# EAGLE design Base (EAGLE 7.1.0)
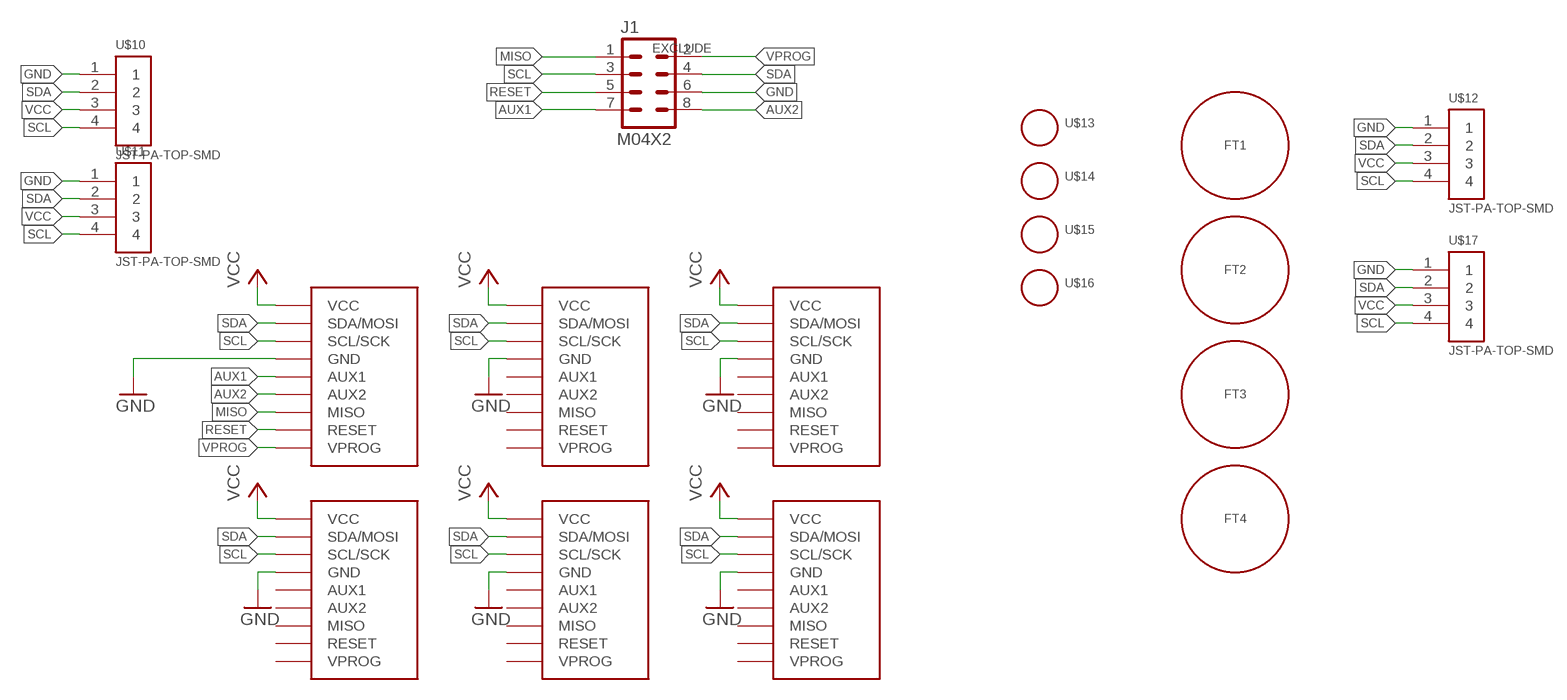
[diagram p0: schematic, sheet 1]

## Parts
FT1  FOOT  [FOOT]
FT2  FOOT  [FOOT]
FT3  FOOT  [FOOT]
FT4  FOOT  [FOOT]
J1  M04X2  [2X4]
U$1  MAGBASE-V2  [MAGBASE-V2]
U$2  MAGBASE-V2  [MAGBASE-V2]
U$3  MAGBASE-V2  [MAGBASE-V2]
U$4  MAGBASE-V2  [MAGBASE-V2]
U$5  MAGBASE-V2  [MAGBASE-V2]
U$6  MAGBASE-V2  [MAGBASE-V2]
U$10  JST-PA-TOP-SMD  [JST-PA-TOP-SMD]
U$11  JST-PA-TOP-SMD  [JST-PA-TOP-SMD]
U$12  JST-PA-TOP-SMD  [JST-PA-TOP-SMD]
U$13  HOLE#4  [HOLE-#4]
U$14  HOLE#4  [HOLE-#4]
U$15  HOLE#4  [HOLE-#4]
U$16  HOLE#4  [HOLE-#4]
U$17  JST-PA-TOP-SMD  [JST-PA-TOP-SMD]

## Nets
AUX1: J1.7 U$1.AUX1
AUX2: J1.8 U$1.AUX2
GND: J1.6 U$1.GND U$2.GND U$3.GND U$4.GND U$5.GND U$6.GND U$10.1 U$11.1 U$12.1 U$17.1
MISO: J1.1 U$1.MISO
RESET: J1.5 U$1.RESET
SCL: J1.3 U$1.SCL(SCL/SCK) U$2.SCL(SCL/SCK) U$3.SCL(SCL/SCK) U$4.SCL(SCL/SCK) U$5.SCL(SCL/SCK) U$6.SCL(SCL/SCK) U$10.4 U$11.4 U$12.4 U$17.4
SDA: J1.4 U$1.SDA(SDA/MOSI) U$2.SDA(SDA/MOSI) U$3.SDA(SDA/MOSI) U$4.SDA(SDA/MOSI) U$5.SDA(SDA/MOSI) U$6.SDA(SDA/MOSI) U$10.2 U$11.2 U$12.2 U$17.2
VCC: U$1.VCC U$2.VCC U$3.VCC U$4.VCC U$5.VCC U$6.VCC U$10.3 U$11.3 U$12.3 U$17.3
VPROG: J1.2 U$1.VPROG
Unconnected: U$2.AUX1 U$2.AUX2 U$2.MISO U$2.RESET U$2.VPROG U$3.AUX1 U$3.AUX2 U$3.MISO U$3.RESET U$3.VPROG U$4.AUX1 U$4.AUX2 U$4.MISO U$4.RESET U$4.VPROG U$5.AUX1 U$5.AUX2 U$5.MISO U$5.RESET U$5.VPROG U$6.AUX1 U$6.AUX2 U$6.MISO U$6.RESET U$6.VPROG U$13.P$1(HOLE) U$14.P$1(HOLE) U$15.P$1(HOLE) U$16.P$1(HOLE)

## Library data of the parts
FT1-FT4 = Modulo:FOOT; PARTNUM: SJ6553
J1 = SparkFun-Connectors:M04X2: .1" header, two rows of four.; PARTNUM: EXCLUDE
U$1-U$6 = Modulo:MAGBASE
U$10-U$12 U$17 = Modulo:JST-PA; PARTNUM: BM04B-PASS-1-TFT(LF)(SN)
U$13-U$16 = Modulo:HOLE; PARTNUM: EXCLUDE

## Board
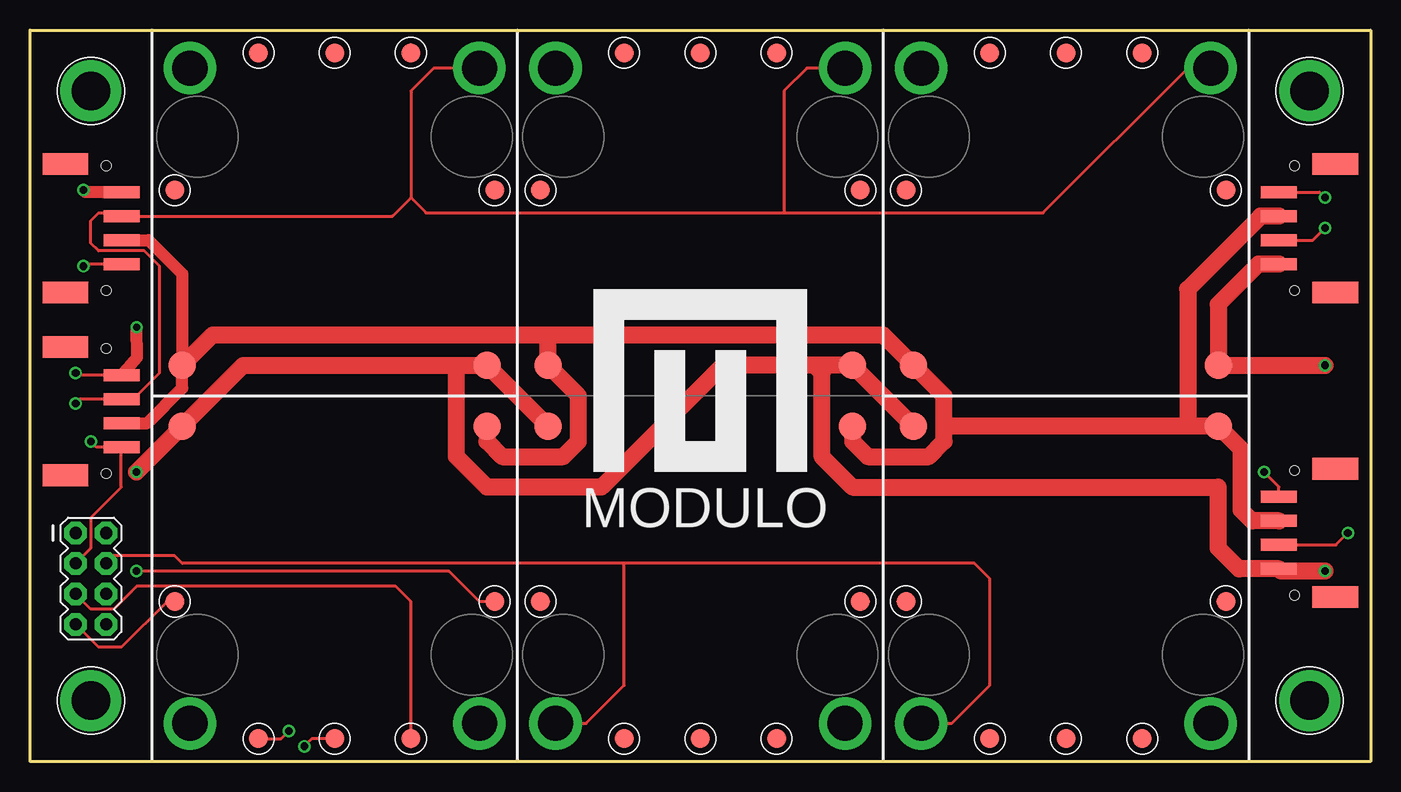
[diagram p1: board, top side]
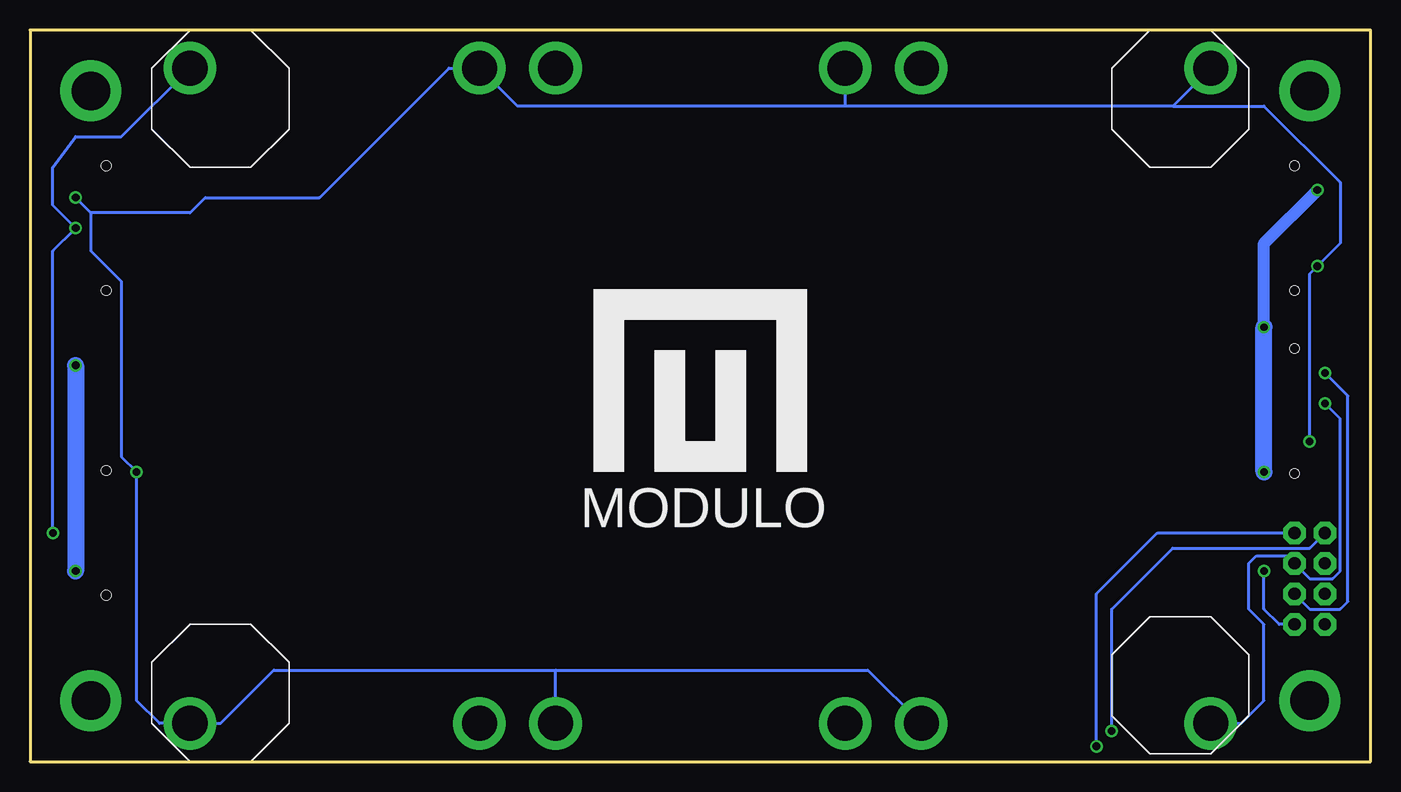
[diagram p2: board, bottom side, seen from below]

Size 111.76 x 60.96 mm. Coordinates in mm from the lower left corner, seen from the top.
Outline: 0,0 0,60.96 111.76,60.96 111.76,0 0,0
Copper layers (1*16): Top 0.0178mm / dielectric 59mil / Bottom 0.0178mm
Design rules "SSC-EAGLE-2Lyr_v1.0.0.3": minimum track width 6mil, minimum drill 14mil, track to track 6mil, track to pad 6mil, pad to pad 6mil, via to via 6mil, smd to smd 6mil, copper to edge 20mil, drill to drill 16mil, minimum pad ring 8mil, minimum via ring 8mil, stop-mask expansion 3mil, vias tented up to drill 0mil, thermal gap 10mil

### Footprints (pad centres in the part's own frame; a part is rotated, then mirrored left to right if it is on the bottom)
2X4 = drill 1.016 pad 1.88 octagon: 1 -3.81,-1.27; 2 -3.81,1.27; 3 -1.27,-1.27; 4 -1.27,1.27; 5 1.27,-1.27; 6 1.27,1.27; 7 3.81,-1.27; 8 3.81,1.27
MAGBASE-V2 = smd 1.587 x 1.587: AUX1 1.905,13.335; AUX2 28.575,13.335; MISO 8.89,1.905; RESET 21.59,1.905; VPROG 15.24,1.905 | smd 2.286 x 2.286: GND 2.54,27.94; VCC 27.94,27.94 | drill 2.921: SCL 27.305,3.175; SDA 3.175,3.175
JST-PA-TOP-SMD = smd 1 x 3: 1 -3,1.3; 2 -1,1.3; 3 1,1.3; 4 3,1.3 | smd 1.8 x 3.8: R1 -5.35,-3.4; R2 5.35,-3.4 | hole 0.8: 5.2,0; -5.2,0
HOLE-#4 = drill 3.198 pad 5.08: P$1 0,0

### Placement (x,y rotation side)
FT1  15.88,55.24 90 bottom
FT2  95.89,55.24 0 bottom
FT3  15.88,6.35 0 bottom
FT4  95.89,5.71 0 bottom
J1  5.08,15.24 270 top
U$1  10.16,0 0 top
U$2  40.64,0 0 top
U$3  71.12,0 0 top
U$4  101.6,60.96 180 top
U$5  71.12,60.96 180 top
U$6  40.64,60.96 180 top
U$10  105.41,44.45 90 top
U$11  6.35,29.21 270 top
U$12  6.35,44.45 270 top
U$13  5.08,5.08 0 top
U$14  106.68,5.08 0 top
U$15  106.68,55.88 0 top
U$16  5.08,55.88 0 top
U$17  105.41,19.05 90 top

### Tracks (layer width: path | path; a pad name or v marks a point on that pad's centre or on a via)
AUX1
  Top 0.254: U$1.AUX1 11.43,13.34 7.62,9.53 5.71,9.53 J1.7
AUX2  (via drill 0.64)
  Top 0.254: U$1.AUX2 37.47,13.34 34.92,15.88 v8.89,15.88
  Bottom 0.254: J1.8 7.62,11.43 8.89,12.7 v8.89,15.88
GND  (via drill 0.6, 0.64)
  Top 0.254: U$11.1 3.98,32.21 v3.81,32.38
  Top 1.016: U$11.1 8.92,33.69 v8.89,36.2 | U$12.1 4.62,47.45 v4.45,47.62
  Top 1.422: U$3.GND U$5.GND 65.41,33.02 | U$2.GND U$6.GND 35.56,33.02 | 65.41,33.02 57.78,33.02 47.62,22.86 38.1,22.86 35.56,25.4 35.56,33.02 | 65.41,33.02 66.04,32.38 66.04,25.4 68.58,22.86 99.06,22.86 99.06,17.78 100.79,16.05 U$17.1 104.28,15.88 v107.95,15.88 | U$10.1 102.41,41.45 99.06,38.1 U$4.GND v107.95,33.02 | 35.56,33.02 17.78,33.02 U$1.GND v8.89,24.13
  Bottom 0.254: J1.6 5.08,12.7 2.54,12.7 1.91,13.34 1.91,30.48 v3.81,32.38
  Bottom 1.016: v8.89,36.2 8.89,43.18 v4.45,47.62
  Bottom 1.422: v8.89,24.13 v8.89,36.2 | v107.95,33.02 v107.95,15.88
MISO  (via drill 0.64)
  Top 0.254: U$1.MISO 20.95,1.91 v21.59,2.54
  Bottom 0.254: v21.59,2.54 21.59,12.7 16.51,17.78 5.08,17.78 J1.1
RESET
  Top 0.254: U$1.RESET 31.75,13.34 30.48,14.61 8.89,14.61 6.99,12.7 5.08,12.7 J1.5
SCL  (via drill 0.64)
  Top 0.254: 103.33,47.45 U$10.4 107.49,47.45 v107.95,46.99 | U$17.4 104.11,22.89 v102.87,24.13 | v5.08,26.67 5.54,26.21 U$11.4 7.62,26.18 7.62,22.86 5.08,20.32 5.08,17.78 J1.3 | U$12.4 4.62,41.45 v4.45,41.27
  Bottom 0.254: U$6.SCL 16.51,54.61 | 16.51,54.61 43.81,54.61 | 43.81,54.61 71.12,54.61 U$4.SCL 76.83,57.78 87.63,46.99 97.16,46.99 98.42,45.72 106.68,45.72 | U$5.SCL 43.81,54.61 | 106.68,45.72 v107.95,46.99 | 106.68,45.72 106.68,42.55 104.14,40.01 104.14,25.4 v102.87,24.13 102.87,5.08 100.97,3.17 U$3.SCL 95.89,3.17 91.44,7.62 67.94,7.62 | 67.94,7.62 41.91,7.62 U$1.SCL | U$2.SCL 67.94,7.62 | v5.08,26.67 5.08,40.64 v4.45,41.27 2.54,43.18 2.54,48.26 8.89,54.61 16.51,54.61
SDA  (via drill 0.64)
  Top 0.254: U$6.SDA 33.66,57.78 31.75,55.88 31.75,46.99 | 31.75,46.99 33.02,45.72 62.87,45.72 | 62.87,45.72 84.45,45.72 96.52,57.78 U$4.SDA | U$5.SDA 64.77,57.78 62.87,55.88 62.87,45.72 | U$10.2 106.95,43.45 v107.95,44.45 | U$17.2 108.86,18.05 v109.86,19.05 | U$3.SDA 76.83,3.17 80.01,6.35 80.01,15.24 78.74,16.51 49.53,16.51 | 49.53,16.51 12.7,16.51 12.06,17.14 6.99,17.14 J1.4 | U$2.SDA 46.35,3.17 49.53,6.35 49.53,16.51 | 31.75,46.99 30.21,45.45 U$12.2 7.38,45.72 5.71,45.72 5.08,45.09 5.08,43.18 5.71,42.55 9.53,42.55 10.79,41.27 10.79,32.38 8.89,30.48 7.38,30.48 U$11.2 4.17,30.21 v3.81,29.84
  Bottom 0.254: U$4.SDA 104.14,52.07 107.95,52.07 109.86,49.53 109.86,46.35 v107.95,44.45 109.86,42.55 v109.86,19.05 | U$1.SDA 10.79,3.17 8.89,5.08 8.89,11.43 10.16,12.7 10.16,16.51 9.53,17.14 6.99,17.14 J1.4 5.08,15.24 3.17,15.24 2.54,15.88 2.54,28.57 v3.81,29.84
VCC
  Top 1.016: U$12.3 9.89,43.45 12.7,40.64 U$6.VCC 12.7,31.11 9.79,28.21 U$11.3
  Top 1.422: U$2.VCC 68.58,26.67 69.85,25.4 74.93,25.4 76.2,26.67 76.2,27.94 | 76.2,27.94 76.2,30.48 U$4.VCC 71.12,35.56 43.18,35.56 | U$1.VCC 38.1,26.67 39.37,25.4 44.45,25.4 45.72,26.67 45.72,30.48 U$5.VCC 43.18,35.56 | U$6.VCC 15.24,35.56 43.18,35.56 | 96.52,27.94 U$3.VCC 100.97,26.04 100.97,20.95 101.87,20.05 U$17.3 | 96.52,27.94 76.2,27.94 | U$10.3 102.6,45.45 96.52,39.37 96.52,27.94
VPROG  (via drill 0.64)
  Top 0.254: U$1.VPROG 23.5,1.91 v22.86,1.27
  Bottom 0.254: v22.86,1.27 22.86,13.97 17.78,19.05 J1.2

### Text on the board
tPlace: MODULO
bPlace: MODULO